# Altium schematic sheet LPRAN.SchDoc: LPRAN
size A4; CompanyName: WiSE Lab; Engineer: Anh Luong; Organization: Carnegie Mellon University; Address1: 4720 Forbes Ave; Address2: CIC 2219F; Address3: Pittsburgh, PA 15213; Address4: USA; Revision: 1; SheetNumber: 1; SheetTotal: 4
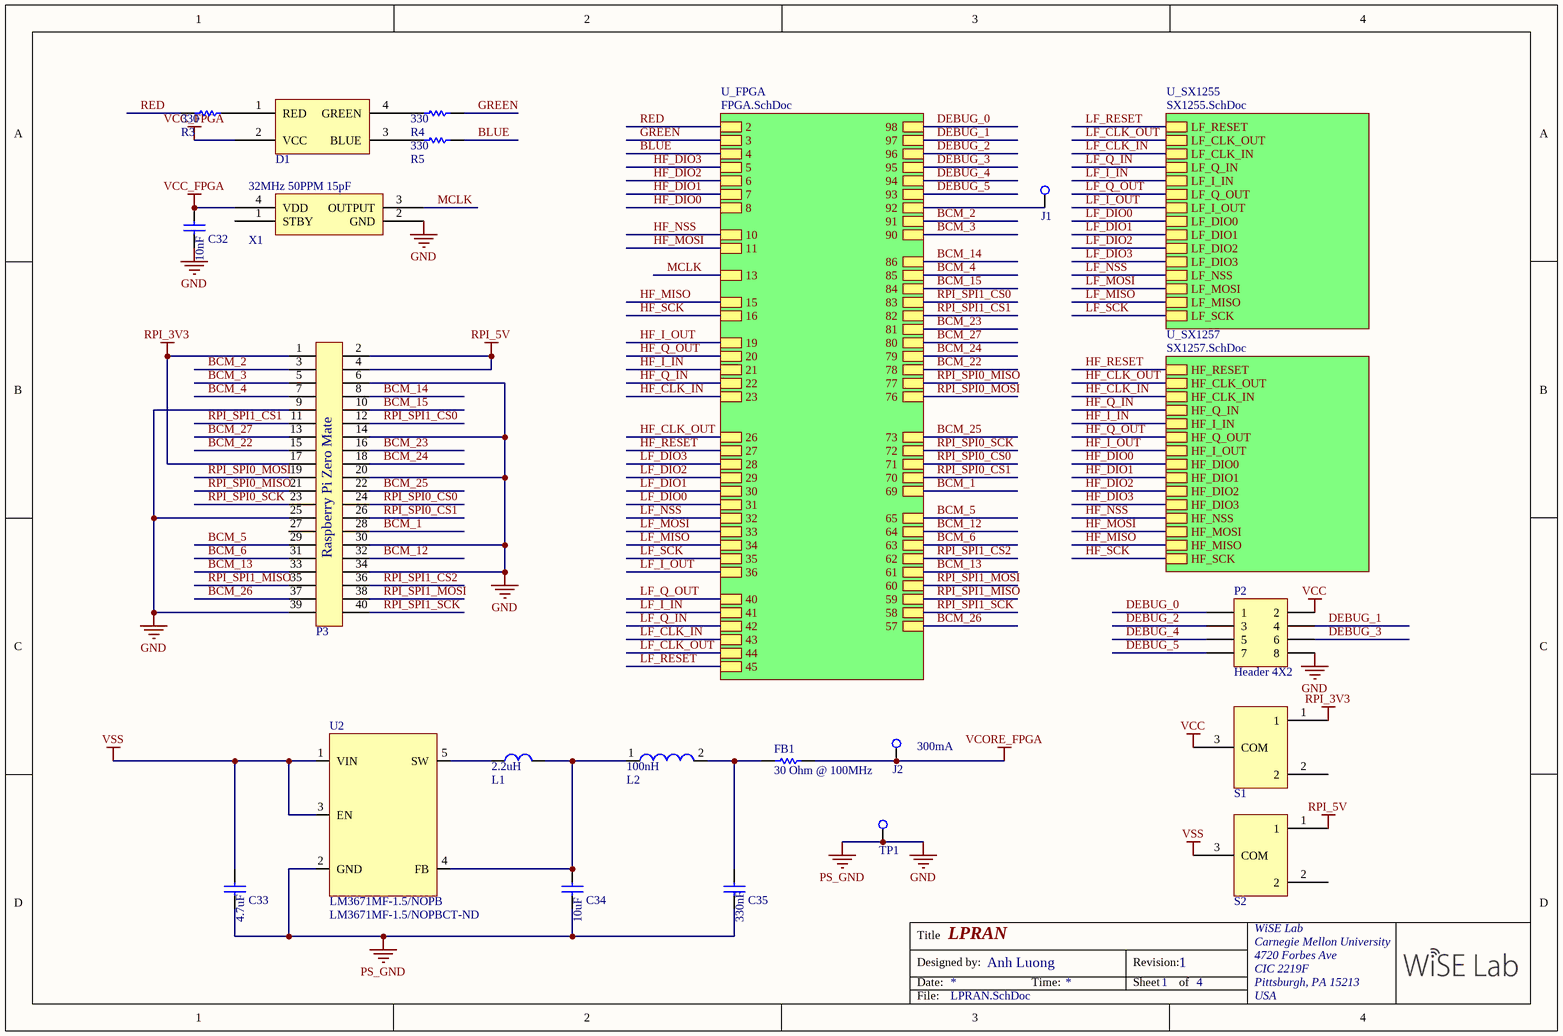
[diagram p0: LPRAN.SchDoc]

## Parts
C32  GRM155R71E103KA01D  [CAPC1005X04L]  (value not drawn)
C33  GRM188R60J475KE19D  [CAPC1608X08N (0603)]  (value not drawn)
C34  GRM188C81C106MA73D  [CAPC1608X08N (0603)]  (value not drawn)
C35  GRM188R71C334KA01D  [CAPC1608X08N (0603)]  (value not drawn)
D1  CLV1A-FKB-CJ1M1F1BB7R4S3  [CREE LV1]  (value not drawn)
FB1  Impedance @ Frequency: 30 Ohm @ 100MHz  [RESC1608X06N (0603)]  (hidden comment: MMZ1608R300A)
J1  5004  [TP]  (value not drawn)
J2  5004  [TP]  (value not drawn)
L1  LQH32CN2R2M33L  [INDC3225X22N]  (value not drawn)
L2  LQG18HNR10J00D  [INDC1608X08N]  (value not drawn)
P2  Header 4X2  [HDR2X4]
P3  Raspbery Pi Zero Mate  [Raspberry Pi Zero]  (value not drawn)
R3  MCR03ERTJ331  [RESC1608X06N (0603)]  (value not drawn)
R4  MCR03ERTJ331  [RESC1608X06N (0603)]  (value not drawn)
R5  MCR03ERTJ331  [RESC1608X06N (0603)]  (value not drawn)
S1  MA12R  [MA12R/TR]  (value not drawn)
S2  MA12R  [MA12R/TR]  (value not drawn)
TP1  CLIP_ON_TP  [CLIP_ON_TP]  (value not drawn)
U2  LM3671MF-1.5/NOPB  Supplier Part Number 1: LM3671MF-1.5/NOPBCT-ND  [SOT95P280X145-5N]
X1  ASE-32.000MHZ-L-C-T  [3.2x2.5x1.2mmXTAL]  (value not drawn)

## Sub-sheets
U_FPGA = FPGA.SchDoc: 98, 97, 96, 95, 94, 93, 92, 91, 90, 86, 85, 84, 83, 45, 44, 43, 42, 41, 40, 36, 35, 34, 33, 32, 31, 30, 29, 28, 27, 26, 22, 20, 19, 16, 15, 10, 6, 4, 2, 23, 21, 11, 73, 57, 58, 59, 61, 63, 62, 64, 65, 70, 71, 8, 7, 5, 3, 13, 69, 60, 72, 81, 80, 79, 78, 77, 76, 82
U_SX1255 = SX1255.SchDoc: LF_RESET, LF_CLK_OUT, LF_CLK_IN, LF_Q_IN, LF_I_IN, LF_Q_OUT, LF_I_OUT, LF_DIO0, LF_DIO1, LF_DIO2, LF_DIO3, LF_NSS, LF_MOSI, LF_MISO, LF_SCK
U_SX1257 = SX1257.SchDoc: HF_RESET, HF_CLK_OUT, HF_CLK_IN, HF_Q_IN, HF_I_IN, HF_Q_OUT, HF_I_OUT, HF_DIO0, HF_DIO1, HF_DIO2, HF_DIO3, HF_NSS, HF_MOSI, HF_MISO, HF_SCK

## Nets
GND: C32.1 C33.1 C34.1 C35.1 P2.8 P3.6 P3.9 P3.14 P3.20 P3.25 P3.30 P3.34 P3.39 TP1.1 U2.2(GND) X1.2(GND)  [also labelled PS_GND]
RPI_3V3: P3.1 P3.17 S1.1
RPI_5V: P3.2 P3.4 S2.1
VCC: P2.2 S1.3(COM)
VCC_FPGA: C32.2 D1.2(VCC) X1.4(VDD)
VCORE_FPGA: FB1.1 J2.1
VSS: C33.2 S2.3(COM) U2.1(VIN) U2.3(EN)
BCM_1: P3.28 ; sheet U_FPGA/69
BCM_2: P3.3 ; sheet U_FPGA/91
BCM_3: P3.5 ; sheet U_FPGA/90
BCM_4: P3.7 ; sheet U_FPGA/85
BCM_5: P3.29 ; sheet U_FPGA/65
BCM_6: P3.31 ; sheet U_FPGA/63
BCM_12: P3.32 ; sheet U_FPGA/64
BCM_13: P3.33 ; sheet U_FPGA/61
BCM_14: P3.8 ; sheet U_FPGA/86
BCM_15: P3.10 ; sheet U_FPGA/84
BCM_22: P3.15 ; sheet U_FPGA/78
BCM_23: P3.16 ; sheet U_FPGA/81
BCM_24: P3.18 ; sheet U_FPGA/79
BCM_25: P3.22 ; sheet U_FPGA/73
BCM_26: P3.37 ; sheet U_FPGA/57
BCM_27: P3.13 ; sheet U_FPGA/80
BLUE: R5.2 ; sheet U_FPGA/4
DEBUG_0: P2.1 ; sheet U_FPGA/98
DEBUG_1: P2.4 ; sheet U_FPGA/97
DEBUG_2: P2.3 ; sheet U_FPGA/96
DEBUG_3: P2.6 ; sheet U_FPGA/95
DEBUG_4: P2.5 ; sheet U_FPGA/94
DEBUG_5: P2.7 ; sheet U_FPGA/93
GREEN: R4.2 ; sheet U_FPGA/3
HF_CLK_IN: sheet U_FPGA/23, sheet U_SX1257/HF_CLK_IN
HF_CLK_OUT: sheet U_FPGA/26, sheet U_SX1257/HF_CLK_OUT
HF_DIO0: sheet U_FPGA/8, sheet U_SX1257/HF_DIO0
HF_DIO1: sheet U_FPGA/7, sheet U_SX1257/HF_DIO1
HF_DIO2: sheet U_FPGA/6, sheet U_SX1257/HF_DIO2
HF_DIO3: sheet U_FPGA/5, sheet U_SX1257/HF_DIO3
HF_I_IN: sheet U_FPGA/21, sheet U_SX1257/HF_I_IN
HF_I_OUT: sheet U_FPGA/19, sheet U_SX1257/HF_I_OUT
HF_MISO: sheet U_FPGA/15, sheet U_SX1257/HF_MISO
HF_MOSI: sheet U_FPGA/11, sheet U_SX1257/HF_MOSI
HF_NSS: sheet U_FPGA/10, sheet U_SX1257/HF_NSS
HF_Q_IN: sheet U_FPGA/22, sheet U_SX1257/HF_Q_IN
HF_Q_OUT: sheet U_FPGA/20, sheet U_SX1257/HF_Q_OUT
HF_RESET: sheet U_FPGA/27, sheet U_SX1257/HF_RESET
HF_SCK: sheet U_FPGA/16, sheet U_SX1257/HF_SCK
LF_CLK_IN: sheet U_FPGA/43, sheet U_SX1255/LF_CLK_IN
LF_CLK_OUT: sheet U_FPGA/44, sheet U_SX1255/LF_CLK_OUT
LF_DIO0: sheet U_FPGA/31, sheet U_SX1255/LF_DIO0
LF_DIO1: sheet U_FPGA/30, sheet U_SX1255/LF_DIO1
LF_DIO2: sheet U_FPGA/29, sheet U_SX1255/LF_DIO2
LF_DIO3: sheet U_FPGA/28, sheet U_SX1255/LF_DIO3
LF_I_IN: sheet U_FPGA/41, sheet U_SX1255/LF_I_IN
LF_I_OUT: sheet U_FPGA/36, sheet U_SX1255/LF_I_OUT
LF_MISO: sheet U_FPGA/34, sheet U_SX1255/LF_MISO
LF_MOSI: sheet U_FPGA/33, sheet U_SX1255/LF_MOSI
LF_NSS: sheet U_FPGA/32, sheet U_SX1255/LF_NSS
LF_Q_IN: sheet U_FPGA/42, sheet U_SX1255/LF_Q_IN
LF_Q_OUT: sheet U_FPGA/40, sheet U_SX1255/LF_Q_OUT
LF_RESET: sheet U_FPGA/45, sheet U_SX1255/LF_RESET
LF_SCK: sheet U_FPGA/35, sheet U_SX1255/LF_SCK
MCLK: X1.3(OUTPUT) ; sheet U_FPGA/13
RED: R3.1 ; sheet U_FPGA/2
RPI_SPI0_CS0: P3.24 ; sheet U_FPGA/71
RPI_SPI0_CS1: P3.26 ; sheet U_FPGA/70
RPI_SPI0_MISO: P3.21 ; sheet U_FPGA/77
RPI_SPI0_MOSI: P3.19 ; sheet U_FPGA/76
RPI_SPI0_SCK: P3.23 ; sheet U_FPGA/72
RPI_SPI1_CS0: P3.12 ; sheet U_FPGA/83
RPI_SPI1_CS1: P3.11 ; sheet U_FPGA/82
RPI_SPI1_CS2: P3.36 ; sheet U_FPGA/62
RPI_SPI1_MISO: P3.35 ; sheet U_FPGA/59
RPI_SPI1_MOSI: P3.38 ; sheet U_FPGA/60
RPI_SPI1_SCK: P3.40 ; sheet U_FPGA/58
NetC34_2: C34.2 L1.2 L2.1 U2.4(FB)
NetC35_2: C35.2 FB1.2 L2.2
NetD1_1: D1.1(RED) R3.2
NetD1_3: D1.3(BLUE) R5.1
NetD1_4: D1.4(GREEN) R4.1
NetJ1_1: J1.1 ; sheet U_FPGA/92
NetL1_1: L1.1 U2.5(SW)

Not connected (* = marked no-connect by the designer): P3 27; S1 2; S2 2; X1 1(STBY)

## Notes on the sheet
- (near J2) 300mA
- Title
- Designed by:
- Date:
- Time:
- Revision:
- Sheet
- of
- File:
- (in symbol ASE-32.000MHZ-L-C-T) 32MHz 50PPM 15pF
- (in symbol GRM155R71E103KA01D) 10nF
- (in symbol GRM188C81C106MA73D) 10uF
- (in symbol GRM188R60J475KE19D) 4.7uF
- (in symbol GRM188R71C334KA01D) 330nF
- (in symbol LQH32CN2R2M33L) 2.2uH

## Library data of the parts
C32 = GRM155R71E103KA01D: CAP CER 10000PF 25V X7R 0402; Manufacturer: Murata Electronics North America; Tolerance: ±10%; Supplier 1: Digi-Key; Manufacturer Part Number: GRM155R71E103KA01D; RoHS: RoHS Compliant; Category: Capacitors; Stock 1: 8083248; Pricing 1: 1=0.1, 10=0.013, 100=0.0056, 500=0.004, 1000=0.00315, 2500=0.00286, 5000=0.00263 (USD); Packaging: Cut Tape (CT); Part Status: Active; Voltage - Rated: 25V; Temperature Coefficient: X7R; Operating Temperature: -55°C ~ 125°C; Features: -; Ratings: -; Applications: General Purpose; Mounting Type: Surface Mount, MLCC; Package / Case: 0402 (1005 Metric); Size / Dimension: 0.039" L x 0.020" W (1.00mm x 0.50mm); Height - Seated (Max): -; Thickness (Max): 0.022" (0.55mm); Lead Spacing: -; Lead Style: -; ComponentLink1URL: http://www.murata.com/~/media/webrenewal/support/library/catalog/products/capacitor/mlcc/c02e.pdf; ComponentLink1Description: http://www.murata.com/~/media/webrenewal/support/library/catalog/products/capacitor/mlcc/c02e.pdf; Supplier Part Number 1: 490-1312-1-ND
C33 = GRM188R60J475KE19D: CAP CER 4.7UF 6.3V 10% X5R 0603; Manufacturer: Murata Electronics North America; Capacitance: 4.7µF; Supplier 1: Digi-Key; Manufacturer Part Number: GRM188R60J475KE19D; RoHS: RoHS Compliant; Category: Capacitors; Stock 1: 446094; Pricing 1: 1=0.12, 10=0.08, 50=0.046, 100=0.038, 250=0.032, 500=0.0268, 1000=0.022 (USD); Packaging: Cut Tape (CT); Tolerance: ±10%; Voltage - Rated: 6.3V; Temperature Coefficient: X5R; Mounting Type: Surface Mount, MLCC; Operating Temperature: -55°C ~ 85°C; Applications: General Purpose; Ratings: -; Package / Case: 0603 (1608 Metric); Size / Dimension: 0.063" L x 0.031" W (1.60mm x 0.80mm); Height - Seated (Max): -; Thickness (Max): 0.035" (0.90mm); Lead Spacing: -; Features: -; Lead Style: -; ComponentLink1URL: http://www.murata.com/~/media/webrenewal/support/library/catalog/products/capacitor/mlcc/c02e.ashx; ComponentLink1Description: http://www.murata.com/~/media/webrenewal/support/library/catalog/products/capacitor/mlcc/c02e.ashx
C34 = GRM188C81C106MA73D: CAP CER 10UF 16V 20% X6S 0603; Manufacturer: Murata Electronics North America; Capacitance: 10µF; Supplier 1: Digi-Key; Manufacturer Part Number: GRM188C81C106MA73D; RoHS: RoHS Compliant; Category: Capacitors; Stock 1: 59274; Pricing 1: 1=0.4, 10=0.349, 50=0.2118, 100=0.1744, 250=0.13952, 500=0.12708, 1000=0.11237 (USD); Packaging: Cut Tape (CT); Tolerance: ±20%; Voltage - Rated: 16V; Temperature Coefficient: X6S; Mounting Type: Surface Mount, MLCC; Operating Temperature: -55°C ~ 105°C; Applications: General Purpose; Ratings: -; Package / Case: 0603 (1608 Metric); Size / Dimension: 0.063" L x 0.031" W (1.60mm x 0.80mm); Height - Seated (Max): -; Thickness (Max): 0.031" (0.80mm); Lead Spacing: -; Features: -; Lead Style: -; ComponentLink1URL: http://www.murata.com/products/catalog/pdf/c02e.pdf; ComponentLink1Description: http://www.murata.com/products/catalog/pdf/c02e.pdf
C35 = GRM188R71C334KA01D: CAP CER 0.33UF 16V X7R 0603; Manufacturer: Murata Electronics North America; Capacitance: 0.33µF; Tolerance: ±10%; Supplier 1: Digi-Key; Manufacturer Part Number: GRM188R71C334KA01D; RoHS: RoHS Compliant; Category: Capacitors; Stock 1: 120176; Pricing 1: 1=0.13, 10=0.092, 50=0.053, 100=0.0437, 250=0.0368, 500=0.03082, 1000=0.0253 (USD); Packaging: Cut Tape (CT); Voltage - Rated: 16V; Temperature Coefficient: X7R; Mounting Type: Surface Mount, MLCC; Operating Temperature: -55°C ~ 125°C; Applications: General Purpose; Ratings: -; Package / Case: 0603 (1608 Metric); Size / Dimension: 0.063" L x 0.031" W (1.60mm x 0.80mm); Height - Seated (Max): -; Thickness (Max): 0.035" (0.90mm); Lead Spacing: -; Features: -; Lead Style: -; ComponentLink1URL: http://www.murata.com/~/media/webrenewal/support/library/catalog/products/capacitor/mlcc/c02e.pdf; ComponentLink1Description: http://www.murata.com/~/media/webrenewal/support/library/catalog/products/capacitor/mlcc/c02e.pdf; Supplier Part Number 1: 490-3294-1-ND
D1 = CLV1A-FKB-CJ1M1F1BB7R4S3: LED RED/GREEN/BLUE PLCC4 SMD; Manufacturer: Cree Inc; Color: Red, Green, Blue (RGB); Wavelength - Dominant: 621.5nm, 530nm, 472.5nm; Wavelength - Peak: 630nm, 527nm, 470nm; Millicandela Rating: 675mcd Red, 1055mcd Green, 337mcd Blue; Voltage - Forward (Vf) (Typ): 2V Red, 3.2V Green, 3.2V Blue; Current - Test: 20mA; Viewing Angle: 120°; Lens Type: Diffused, White; Lens Style/Size: Round with Flat Top, 2.2mm; Supplier 1: Digi-Key; Manufacturer Part Number: CLV1A-FKB-CJ1M1F1BB7R4S3; RoHS: RoHS Compliant; Category: Optoelectronics; Stock 1: 254000; Pricing 1: 2000=0.354, 50000=0.329, 100000=0.307 (USD); Packaging: Tape & Reel (TR); Package / Case: 4-PLCC; Size / Dimension: 3.20mm L x 2.80mm W; Height: 2.10mm; Mounting Type: Surface Mount; Luminous Flux @ Current - Test: -; ComponentLink1URL: http://www.cree.com/~/media/Files/Cree/LED%20Components%20and%20Modules/HB/Data%20Sheets/CLV1AFKB(874).pdf; ComponentLink1Description: http://www.cree.com/~/media/Files/Cree/LED%20Components%20and%20Modules/HB/Data%20Sheets/CLV1AFKB(874).pdf
FB1 = MMZ1608R300A: FERRITE CHIP BEAD 30 OHM SMD; Manufacturer: TDK Corporation; Manufacturer Part Number: MMZ1608R300ATA00; Current Rating: 1.5A; DC Resistance (DCR): 50 mOhm Max; Filter Type: Differential Mode - Single; Supplier 1: Digi-Key; RoHS: RoHS Compliant; Category: Filters; Stock 1: 52000; Pricing 1: 4000=0.016, 8000=0.0145, 12000=0.014, 28000=0.013, 100000=0.01285 (USD); Package / Case: 0603 (1608 Metric); Mounting Type: Surface Mount; Packaging: Tape & Reel (TR); Height (Max): 0.037" (0.95mm); Size / Dimension: 0.063" L x 0.031" W (1.60mm x 0.80mm); ComponentLink1URL: http://www.tdk.co.jp/tefe02/e9412_mmz.pdf; ComponentLink1Description: http://www.tdk.co.jp/tefe02/e9412_mmz.pdf; Supplier Part Number 1: 445-2181-2-ND
J1 J2 = 5004: TEST POINT PC MINI .040"D YELLOW; Manufacturer: Keystone Electronics; Supplier 1: Digi-Key; Manufacturer Part Number: 5004; RoHS: RoHS Compliant; Category: Test and Measurement; Stock 1: 45761; Pricing 1: 1=0.34, 10=0.318, 50=0.232, 100=0.2228, 250=0.20008, 500=0.191, 1000=0.15916, 2500=0.14552, 5000=0.13643 (USD); Packaging: Bulk; Type: PC Test Point, Miniature; Terminal: 0.010" x 0.020" (0.25mm x 0.51mm) Phosphor Bronze Wire, Silver Plated; Mounting Type: 0.040" (1.02mm) Hole Diameter; Material: Base, Nylon 46, UL 94V-0; Color: Yellow; ComponentLink1URL: http://www.keyelco.com/product-pdf.cfm?p=1313; ComponentLink1Description: http://www.keyelco.com/product-pdf.cfm?p=1313
L1 = LQH32CN2R2M33L: FIXED IND 2.2UH 790MA 97 MOHM; Manufacturer: Murata Electronics North America; Type: Wirewound; Material - Core: Ferrite; Inductance: 2.2µH; Tolerance: ±20%; Shielding: Unshielded; DC Resistance (DCR): 97 mOhm; Frequency - Self Resonant: 64MHz; Frequency - Test: 1MHz; Supplier 1: Digi-Key; Manufacturer Part Number: LQH32CN2R2M33L; RoHS: RoHS Compliant; Category: Inductors, Coils, Chokes; Stock 1: 5783; Pricing 1: 1=0.32, 10=0.291, 25=0.2584, 50=0.2262, 100=0.21, 250=0.1938, 500=0.18412, 750=0.16796, 1000=0.14858 (USD); Packaging: Cut Tape (CT); Current Rating: 790mA; Current - Saturation: -; Q @ Freq: -; Operating Temperature: -40°C ~ 85°C; Mounting Type: Surface Mount; Package / Case: 1210 (3225 Metric); Size / Dimension: 0.126" L x 0.098" W (3.20mm x 2.50mm); Height - Seated (Max): 0.086" (2.20mm); Supplier Device Package: 1210 (3225 Metric); ComponentLink1URL: http://search.murata.co.jp/Ceramy/image/img/PDF/ENG/L0080S0140LQH32C_23~33.pdf; ComponentLink1Description: http://search.murata.co.jp/Ceramy/image/img/PDF/ENG/L0080S0140LQH32C_23~33.pdf
L2 = LQG18HNR10J00D: INDUCTOR 100NH 300MA 0603; Manufacturer: Murata Electronics North America; Type: Multilayer; Material - Core: Air; Tolerance: ±5%; Shielding: Unshielded; DC Resistance (DCR): 900 mOhm Max; Q @ Freq: 12 @ 100MHz; Frequency - Self Resonant: 800MHz; Frequency - Test: 100MHz; Supplier 1: Digi-Key; Manufacturer Part Number: LQG18HNR10J00D; RoHS: RoHS Compliant; Category: Inductors, Coils, Chokes; Stock 1: 8292; Pricing 1: 1=0.26, 10=0.24, 25=0.216, 50=0.1872, 100=0.168, 250=0.156, 500=0.144, 750=0.1368, 1000=0.1248 (USD); Packaging: Cut Tape (CT); Inductance: 100nH; Current Rating: 300mA; Current - Saturation: -; Operating Temperature: -40°C ~ 85°C; Mounting Type: Surface Mount; Package / Case: 0603 (1608 Metric); Size / Dimension: 0.063" L x 0.031" W (1.60mm x 0.80mm); Height - Seated (Max): 0.037" (0.95mm); Supplier Device Package: 0603 (1608 Metric); ComponentLink1URL: http://search.murata.co.jp/Ceramy/image/img/PDF/ENG/L0075S0083LQG18H.pdf; ComponentLink1Description: http://search.murata.co.jp/Ceramy/image/img/PDF/ENG/L0075S0083LQG18H.pdf
P2 = Header 4X2: Header, 4-Pin, Dual row; LatestRevisionDate: 17-Jul-2002; LatestRevisionNote: Re-released for DXP Platform.; Publisher: Altium Limited
P3 = Raspberry Pi Zero Mate: The header and mechanical drawings for connnecting a Raspbery Pi Zero
R3-R5 = MCR03ERTJ331: RES 330 OHM 1/10W 5% 0603 SMD; Manufacturer: Rohm Semiconductor; Resistance (Ohms): 330; Power (Watts): 0.1W, 1/10W; Temperature Coefficient: ±200ppm/°C; Supplier 1: Digi-Key; Manufacturer Part Number: MCR03ERTJ331; RoHS: RoHS Compliant; Category: Resistors; Stock 1: 12878; Pricing 1: 1=0.1, 10=0.013, 25=0.0092, 100=0.0052, 250=0.00396, 500=0.00316, 1000=0.00233 (USD); Packaging: Digi-Reel®; Tolerance: ±5%; Composition: Thick Film; Features: -; Package / Case: 0603 (1608 Metric); Supplier Device Package: 0603 (1608 Metric); Size / Dimension: 0.063" L x 0.031" W (1.60mm x 0.80mm); Height: 0.022" (0.55mm); Number of Terminations: 2; ComponentLink1URL: http://rohmfs.rohm.com/en/products/databook/datasheet/passive/resistor/chip_resistor/mcr_g.pdf; ComponentLink1Description: http://rohmfs.rohm.com/en/products/databook/datasheet/passive/resistor/chip_resistor/mcr_g.pdf
S1 S2 = MA12R: SWITCH SLIDE SPDT 300MA 4V; Manufacturer: Apem Inc.; Contact Timing: Not Specified; Switch Function: On-On; Current Rating: 300mA (DC); Actuator Type: Standard; Actuator Length: 1.50mm; Actuator Material: Liquid Crystal Polymer (LCP); Electrical Life: 10,000 Cycles; Operating Force: 200gf; Supplier 1: Digi-Key; Manufacturer Part Number: MA12R; RoHS: RoHS Compliant; Category: Switches; Stock 1: 235; Pricing 1: 1=0.86, 50=0.7224, 100=0.688, 500=0.5676, 1000=0.5504, 5000=0.4816 (USD); Packaging: Tube; Part Status: Active; Circuit: SPDT; Voltage Rating - AC: -; Voltage Rating - DC: 4V; Contact Material: Beryllium Copper; Contact Finish: Silver; Mounting Type: Surface Mount, Right Angle; Termination Style: Gull Wing; Features: Board Guide; Switch Travel: 1.50mm; Operating Temperature: -10°C ~ 60°C; Mechanical Life: -; ComponentLink1URL: http://www.apem.com/files/apem/brochures/MA_MICRO_SLIDE.pdf; ComponentLink1Description: http://www.apem.com/files/apem/brochures/MA_MICRO_SLIDE.pdf; Supplier Part Number 1: 679-3555-ND
U2 = LM3671MF-1.5/NOPB: IC REG BUCK 1.5V 0.6A SYNC SOT23; Manufacturer: Texas Instruments; Function: Step-Down; Output Configuration: Positive; Output Type: Fixed; Number of Outputs: 1; Voltage - Input (Min): 2.7V; Voltage - Input (Max): 5.5V; Current - Output: 600mA; Frequency - Switching: 2MHz; Synchronous Rectifier: Yes; Supplier 1: Digi-Key; Manufacturer Part Number: LM3671MF-1.5/NOPB; RoHS: RoHS Compliant; Category: Integrated Circuits (ICs); Stock 1: 845; Pricing 1: 1=1.47, 10=1.313, 100=1.0234, 500=0.84542 (USD); Packaging: Cut Tape (CT); Part Status: Active; Topology: Buck; Voltage - Output (Min/Fixed): 1.5V; Voltage - Output (Max): -; Operating Temperature: -40°C ~ 85°C (TA); Mounting Type: Surface Mount; Package / Case: SC-74A, SOT-753; Supplier Device Package: SOT-23-5; ComponentLink1URL: http://www.ti.com/lit/ds/symlink/lm3671.pdf; ComponentLink1Description: http://www.ti.com/lit/ds/symlink/lm3671.pdf
X1 = ASE-32.000MHZ-L-C-T: Standard Clock Oscillators 32.000M 3.3V 50ppm; Manufacturer: ABRACON; Frequency: 32 MHz; Load Capacitance: 15 pF; Output Format: CMOS; Supplier 1: Mouser; Manufacturer Part Number: ASE-32.000MHZ-L-C-T; RoHS: RoHS Compliant; Category: Standard Clock Oscillators; Stock 1: 0; Pricing 1: 1000=0.959, 2000=0.910, 5000=0.878, 10000=0.845 (USD); Frequency Stability: 50 PPM; Height: 1 mm; Length: 3.2 mm; Package / Case: 3.2 mm x 2.5 mm; Packaging: Reel; Product: Standard Clock Oscillators; Series: ASE; Termination Style: SMD/SMT; Type: XO - Crystal Clock Oscillators; Width: 2.5 mm; Brand: ABRACON; Mounting Style: SMD/SMT; Maximum Operating Temperature: + 85 C; Minimum Operating Temperature: - 40 C; Operating Supply Voltage: 3.3 V; Standard Pack Qty: 1000; RoHS - Mouser: Y; Minimum Order Quantity: 1000; Reeling: True; ComponentLink1URL: http://www.mouser.com/ds/2/3/ASEseries-38758.pdf; ComponentLink1Description: http://www.mouser.com/ds/2/3/ASEseries-38758.pdf; Supplier Part Number 1: 815-ASE-32.000MLCT